# Altium schematic sheet EDU_High-Speed-Design_CPU_Uart.SchDoc: CPU Uart
size 279 x 215 mm; Date: not used; ApprovedBy: not used; CheckedBy: not used; Author: not used; DrawnBy: not used; Organization: not used; Address4: not used; SheetNumber: 23; SheetTotal: 26; Time: not used; ImagePath: not used; Application_BuildNumber: not used
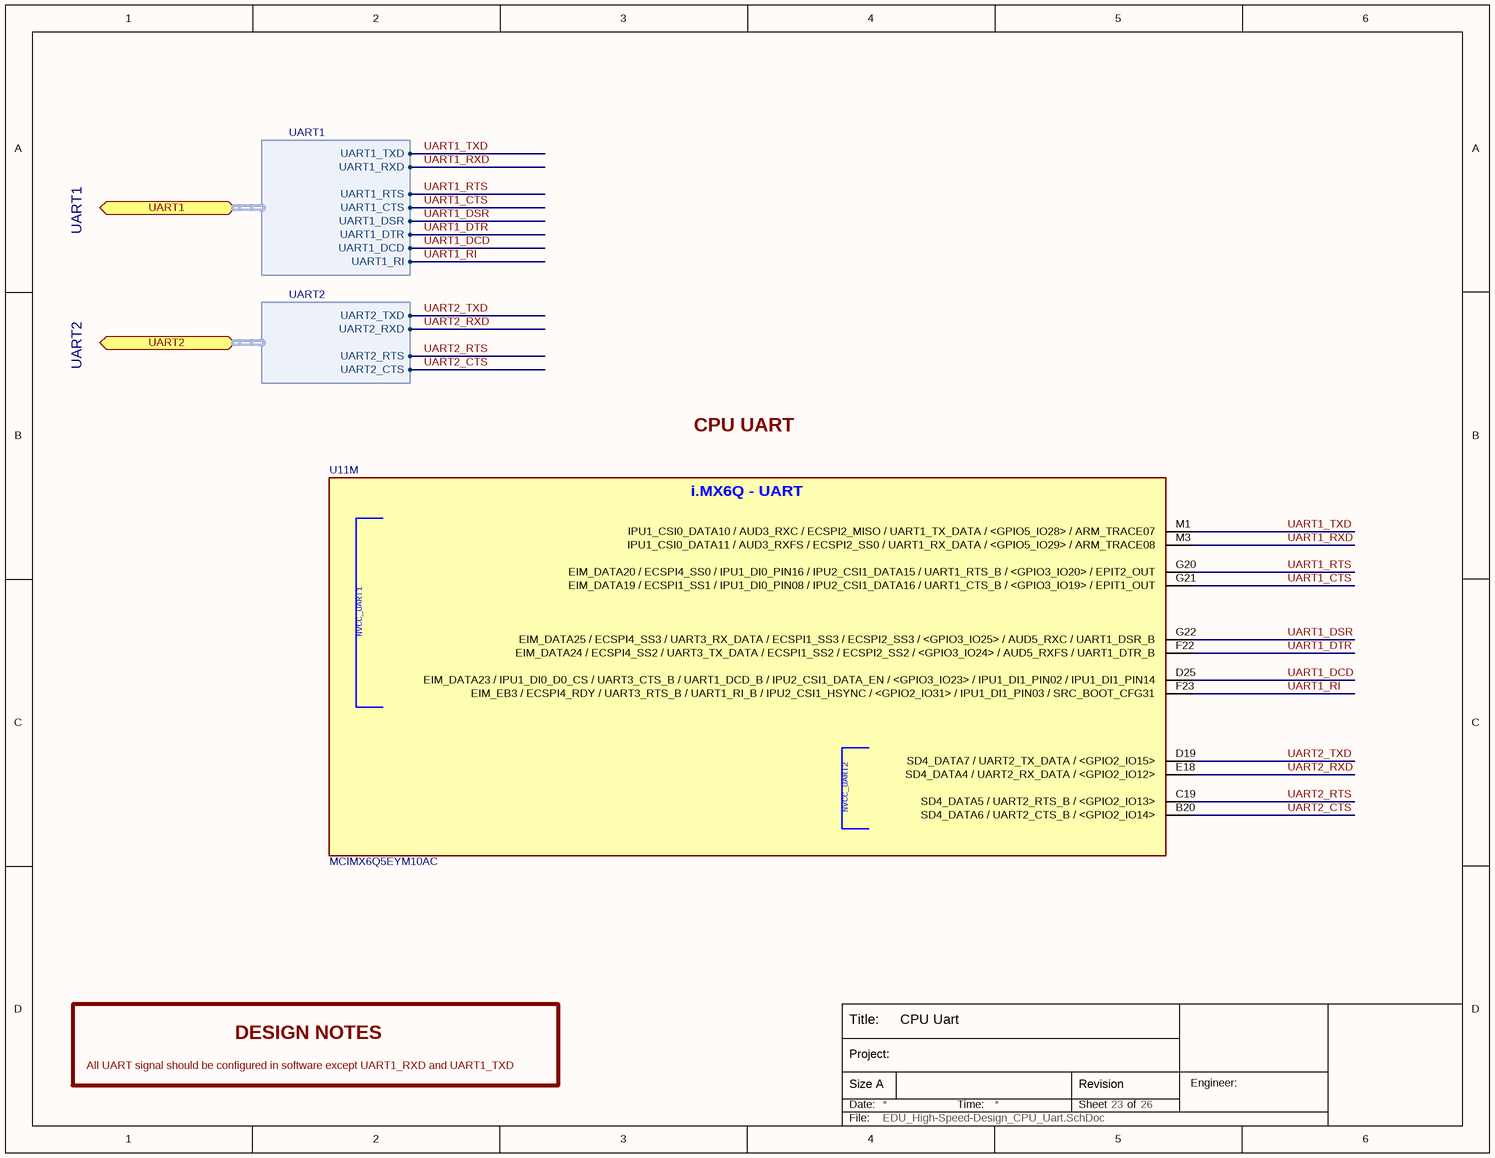
[diagram p0: EDU_High-Speed-Design_CPU_Uart.SchDoc]

## Parts
U11  MCIMX6Q5EYM10AC  [MCIMX6Q5EYM10AC]  (part M of 15)

## Ports
UART1 (bidir, harness UART1), UART2 (bidir, harness UART2)

## Harnesses
UART1: UART1_TXD, UART1_RTS, UART1_CTS, UART1_RXD, UART1_DSR, UART1_DTR, UART1_DCD, UART1_RI
UART2: UART2_TXD, UART2_RTS, UART2_CTS, UART2_RXD

## Nets
UART1_CTS: U11.G21(EIM_DATA19_/_ECSPI1_SS1_/_IPU1_DI0_PIN08_/_IPU2_CSI1_DATA16_/_UART1_CTS_B_/_<GPIO3_IO19>_/_EPIT1_OUT) ; port UART1.UART1_CTS
UART1_DCD: U11.D25(EIM_DATA23_/_IPU1_DI0_D0_CS_/_UART3_CTS_B_/_UART1_DCD_B_/_IPU2_CSI1_DATA_EN_/_<GPIO3_IO23>_/_IPU1_DI1_PIN02_/_IPU1_DI1_PIN14) ; port UART1.UART1_DCD
UART1_DSR: U11.G22(EIM_DATA25_/_ECSPI4_SS3_/_UART3_RX_DATA_/_ECSPI1_SS3_/_ECSPI2_SS3_/_<GPIO3_IO25>_/_AUD5_RXC_/_UART1_DSR_B) ; port UART1.UART1_DSR
UART1_DTR: U11.F22(EIM_DATA24_/_ECSPI4_SS2_/_UART3_TX_DATA_/_ECSPI1_SS2_/_ECSPI2_SS2_/_<GPIO3_IO24>_/_AUD5_RXFS_/_UART1_DTR_B) ; port UART1.UART1_DTR
UART1_RI: U11.F23(EIM_EB3_/_ECSPI4_RDY_/_UART3_RTS_B_/_UART1_RI_B_/_IPU2_CSI1_HSYNC_/_<GPIO2_IO31>_/_IPU1_DI1_PIN03_/_SRC_BOOT_CFG31) ; port UART1.UART1_RI
UART1_RTS: U11.G20(EIM_DATA20_/_ECSPI4_SS0_/_IPU1_DI0_PIN16_/_IPU2_CSI1_DATA15_/_UART1_RTS_B_/_<GPIO3_IO20>_/_EPIT2_OUT) ; port UART1.UART1_RTS
UART1_RXD: U11.M3(IPU1_CSI0_DATA11_/_AUD3_RXFS_/_ECSPI2_SS0_/_UART1_RX_DATA_/_<GPIO5_IO29>_/_ARM_TRACE08) ; port UART1.UART1_RXD
UART1_TXD: U11.M1(IPU1_CSI0_DATA10_/_AUD3_RXC_/_ECSPI2_MISO_/_UART1_TX_DATA_/_<GPIO5_IO28>_/_ARM_TRACE07) ; port UART1.UART1_TXD
UART2_CTS: U11.B20(SD4_DATA6_/_UART2_CTS_B_/_<GPIO2_IO14>) ; port UART2.UART2_CTS
UART2_RTS: U11.C19(SD4_DATA5_/_UART2_RTS_B_/_<GPIO2_IO13>) ; port UART2.UART2_RTS
UART2_RXD: U11.E18(SD4_DATA4_/_UART2_RX_DATA_/_<GPIO2_IO12>) ; port UART2.UART2_RXD
UART2_TXD: U11.D19(SD4_DATA7_/_UART2_TX_DATA_/_<GPIO2_IO15>) ; port UART2.UART2_TXD

## Notes on the sheet
- UART1
- UART2
- CPU UART
- DESIGN NOTES
- All UART signal should be configured in software except UART1_RXD and UART1_TXD
- Title:
- Date:
- Size A
- Project:
- Time:
- Sheet
- Revision
- of
- Engineer:
- File:
- (in symbol MCIMX6Q5EYM10AC, part M) i.MX6Q - UART; NVCC_UART1; NVCC_UART2

## Library data of the parts
U11 = MCIMX6Q5EYM10AC: IC MCU 32BIT ARM QUAD 624FCBGA; Manufacturer 1: Freescale Semiconductor; Supplier 1: Digi-Key; Manufacturer Part Number 1: MCIMX6Q5EYM10AC; Supplier Part Number 1: MCIMX6Q5EYM10AC-ND